# Altium schematic sheet debug_LED.SchDoc
size A3; DocumentNumber: 9; SheetNumber: 9; SheetTotal: 24; SheetDescription: Debug LEDs for MCU0
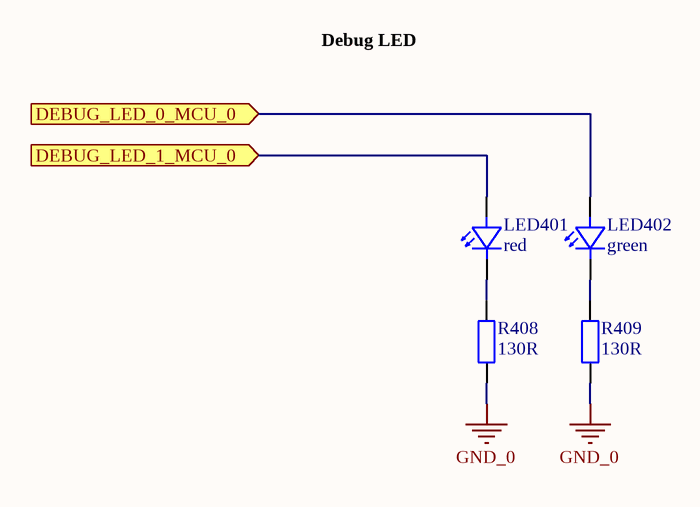
[diagram p0: debug_LED.SchDoc]

## Parts
LED401  red  [LEDC1608X07N]
LED402  green  [LEDC1608X07N]
R408  130R  [RESC1608X05N]
R409  130R  [RESC1608X05N]

## Ports
DEBUG_LED_0_MCU_0 (in), DEBUG_LED_1_MCU_0 (in)

## Nets
GND_0: R408.1 R409.1
DEBUG_LED_0_MCU_0: LED402.2(A) ; port DEBUG_LED_0_MCU_0
DEBUG_LED_1_MCU_0: LED401.2(A) ; port DEBUG_LED_1_MCU_0
NetLED401_1: LED401.1(C) R408.2
NetLED402_1: LED402.1(C) R409.2

## Notes on the sheet
- Debug LED
- Fraunhofer IISB
- Schottkystr. 10
- developed by:
- 91058 Erlangen
- Germany
- Author
- Project
- License
- Description
- File
- Version
- Release Date
- Sheet
- www.foxbms.org
- www.iisb.fraunhofer.de
- foxBMS Team
- /

## Library data of the parts
LED401 = gen_LED_0603_red: LED; Breakdown Voltage: 5V; Continuous Forward Current: 20mA; Forward Voltage @ 20mA: 2V; Automotive Qualified: False; Part Number: gen_LED_0603_red; Color: red; PnP Package: LED_0603; Supplier 1: Farnell; Supplier Part Number 1: 2099221
LED402 = gen_LED_0603_green: LED; Breakdown Voltage: 5V; Continuous Forward Current: 20mA; Forward Voltage @ 20mA: 2.2V; Automotive Qualified: False; Part Number: gen_LED_0603_green; Color: green; PnP Package: LED_0603; Supplier 1: Farnell; Supplier Part Number 1: 2099223
R408 R409 = gen_R_130R_0603: SMD Resistor 130R 0603; Tolerance: 1%; Power: 0.1W; Case EIA: 0603; Case Metric: 1608; Maximum Working Voltage: 75V; PnP Package: R_0603; Automotive Qualified: False; Part Number: gen_R_130R_0603; Operating Temperature: -55°C - +155°C; Resistance: 130R; Series: E24, E96; PnP Value: 130R; Supplier 1: Farnell; Supplier Part Number 1: 2379959